# EAGLE design Grove - ADC for load cell (HX711) (EAGLE 9.2.2)
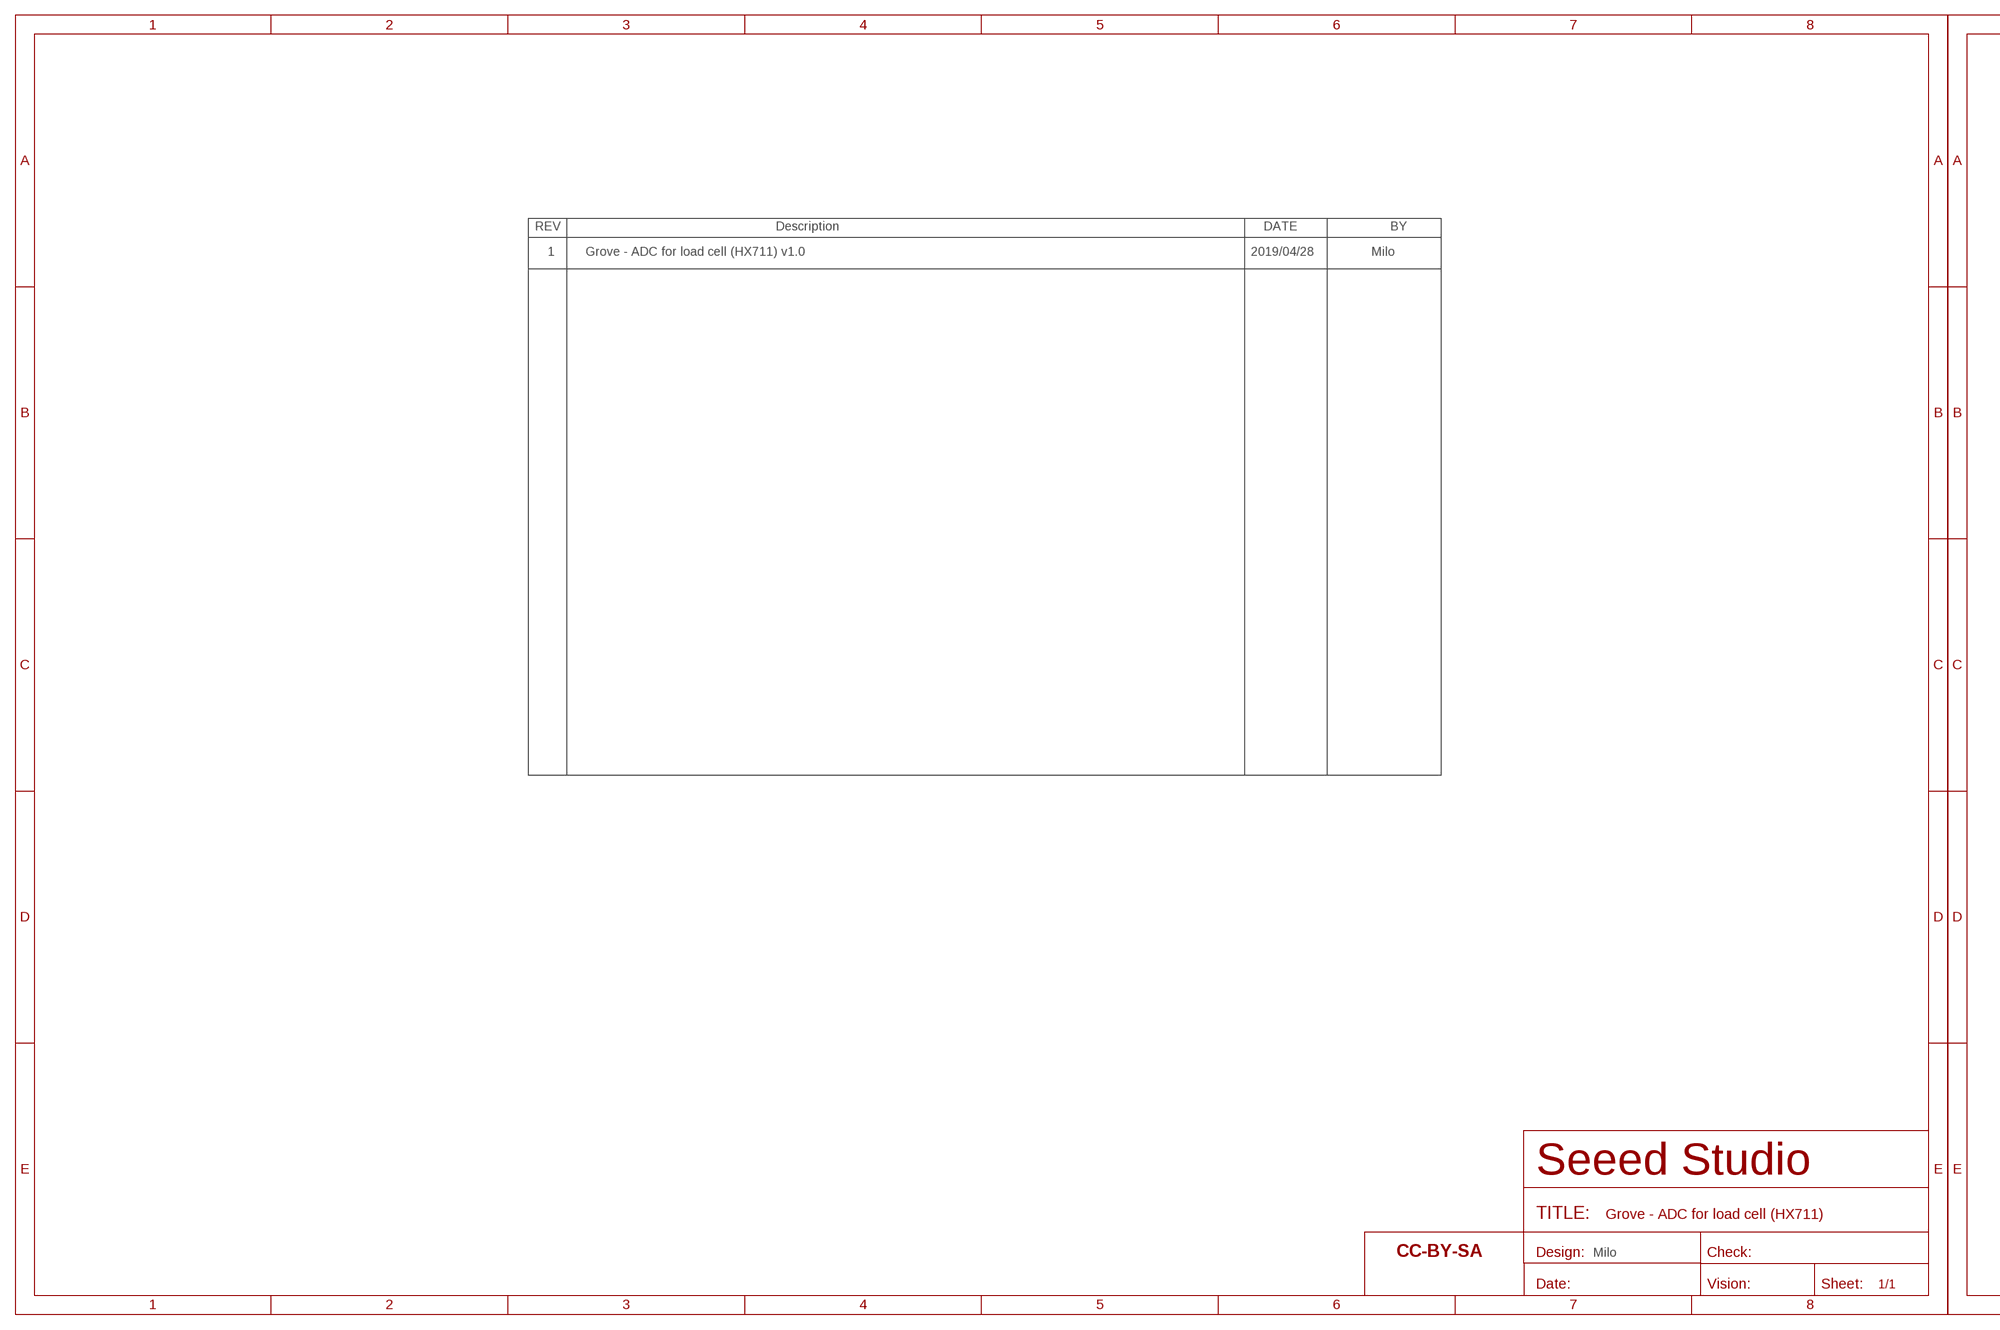
[diagram p0: schematic, sheet 1, part 1 of 2]
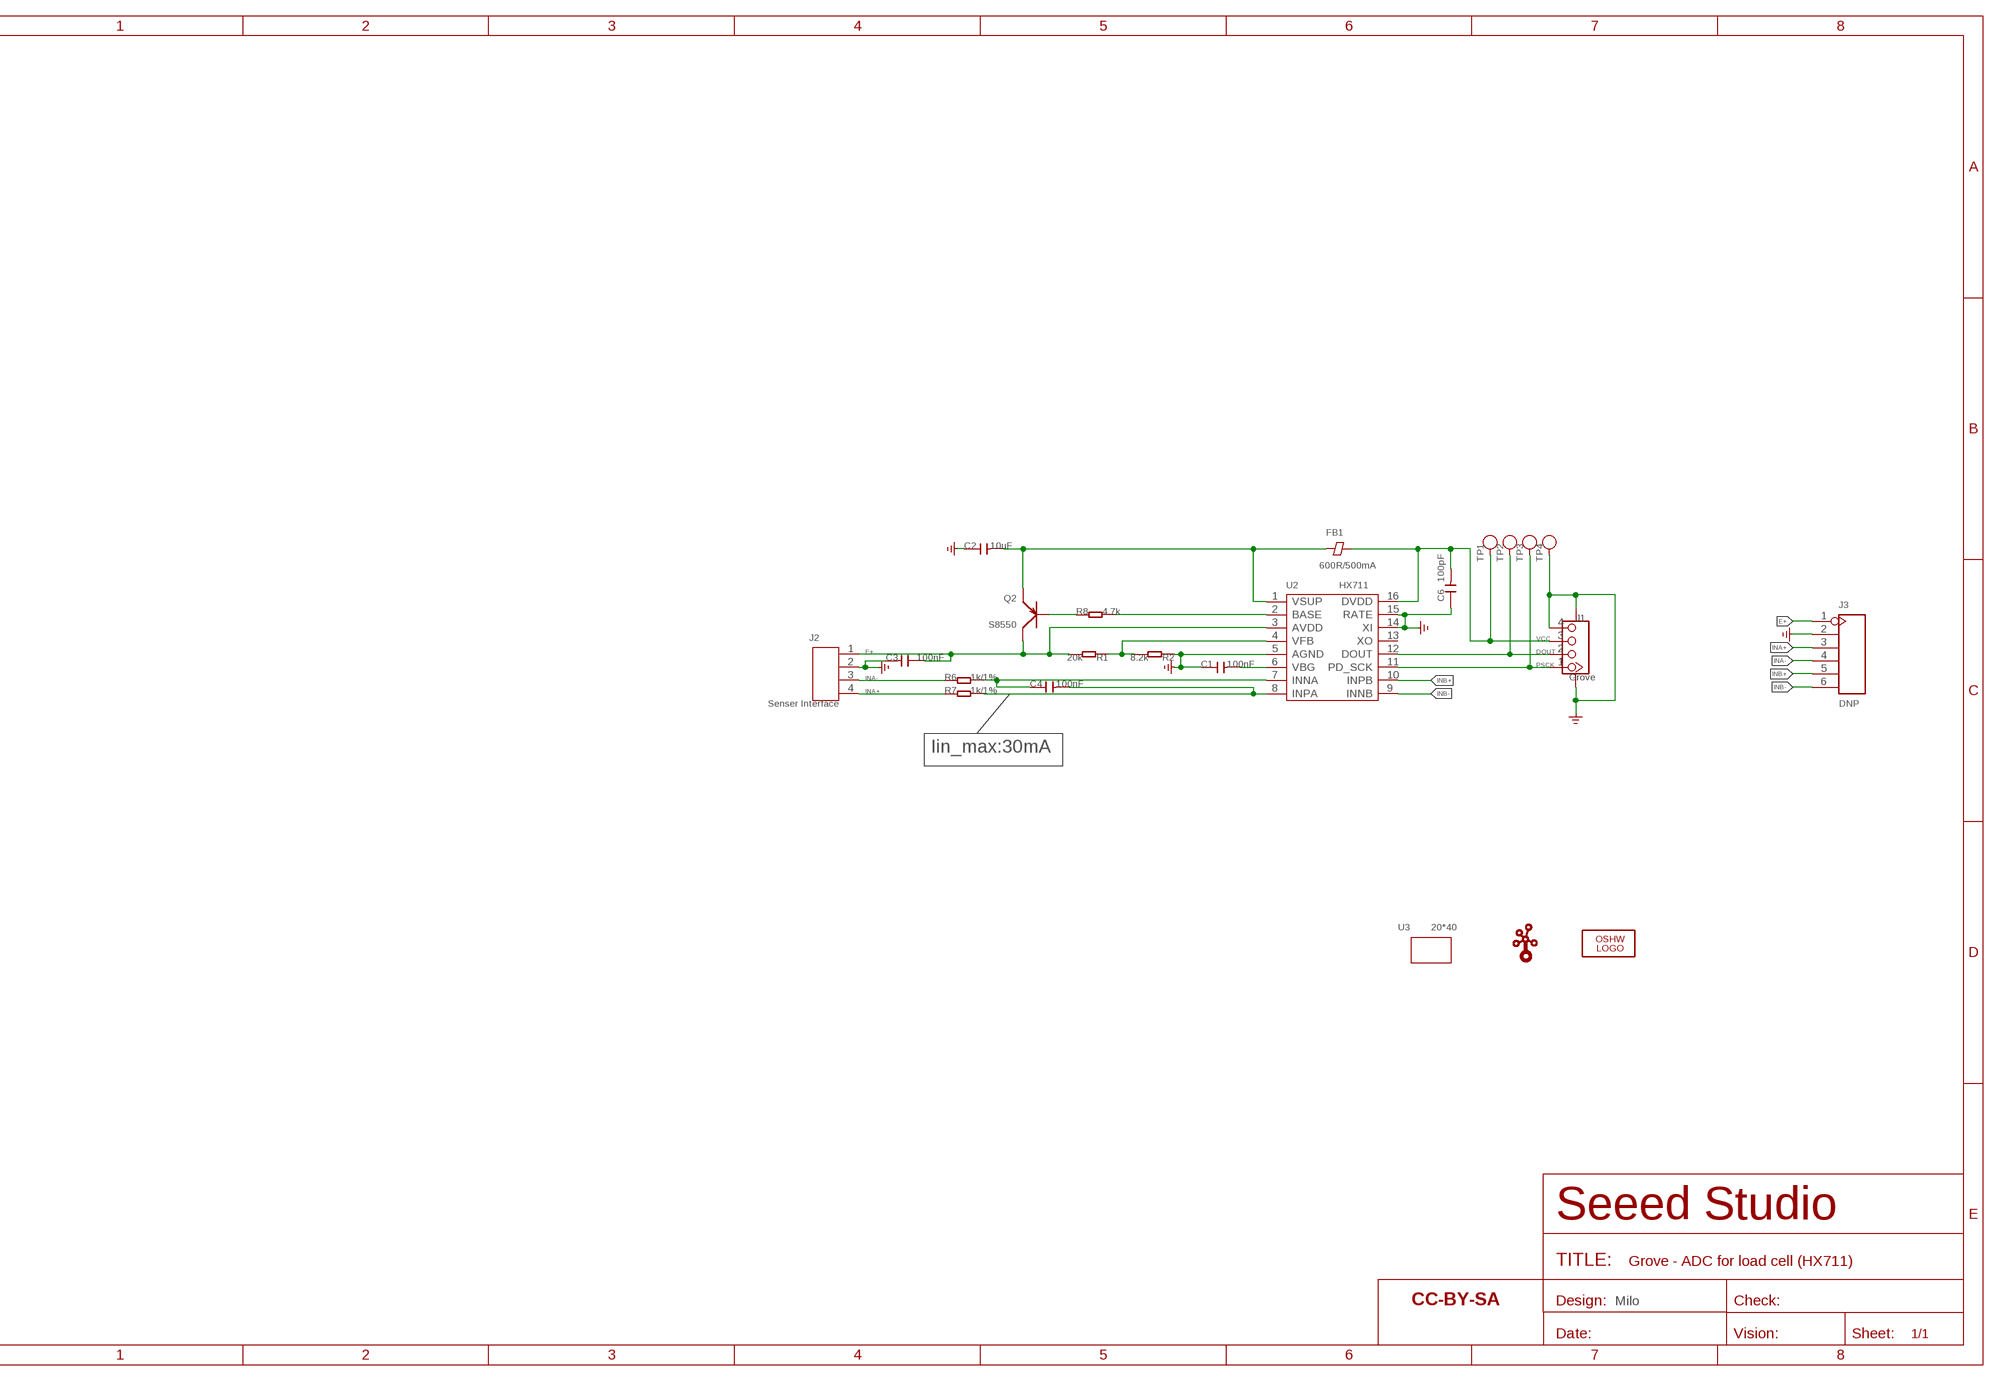
[diagram p1: schematic, sheet 1, part 2 of 2]

## Parts
C1  100nF  CAP-0603  [C0603]
C2  10uF  CAP-0603  [C0603]
C3  100nF  CAP-0603  [C0603]
C4  100nF  CAP-0603  [C0603]
C6  100pF  CAP-0603  [C0603]
FB1  600R/500mA  FERRITE-BEAD-0805  [F0805]
J1  Grove  GROVE-CONNECTOR-SMD-320110030  [HW4-SMD-2.0]
J2  Senser Interface  SCREW-TERMINAL-4P'3.5'  [H4-3.5-14.0X7.0MM]
J3  DNP  HEADER-6P-55/35MIL  [H6-2.54]
LOGO1  LOGO-OSHW-FILLX0150-NT  [OSHW_FILLX150_NOTEXT]
Q2  S8550  TRANSISTOR-PNP-SOT23  [SOT-23]
R1  20k  RES-0603  [R0603]
R2  8.2k  RES-0603  [R0603]
R6  1k/1%  RES-0603  [R0603]
R7  1k/1%  RES-0603  [R0603]
R8  4.7k  RES-0603  [R0603]
TP1  DNP  TEST-POINT'4545'  [TP-D45MIL]
TP2  DNP  TEST-POINT'4545'  [TP-D45MIL]
TP3  DNP  TEST-POINT'4545'  [TP-D45MIL]
TP4  DNP  TEST-POINT'4545'  [TP-D45MIL]
U2  HX711  CONVERTER-HX711  [SOIC16-1.27-10X3.9MM]
U3  20*40  GROVE-1X2-TOP  [GROVE-1*2-TEST-PLATFORM-TOP]
U$2  LOGO-GROVE  [GROVE-SILK-BIG]

## Nets
DOUT: J1.2 TP2.T U2.12(DOUT)
E+: C3.1 J2.1 J3.1 Q2.3(C) R1.2 U2.3(AVDD)
GND: C1.1 C2.1 C3.2 C6.1 J1.4 J1.SS1 J1.SS2 J2.2 J3.2 R2.1 TP4.T U2.5(AGND) U2.14(XI) U2.15(RATE) ; supply symbol labelled GND_POWER
INA+: J2.4 J3.3 R7.1
INA-: J2.3 J3.4 R6.1
INB+: J3.5 U2.10(INPB)
INB-: J3.6 U2.9(INNB)
N$2: R1.1 R2.2 U2.4(VFB)
N$4: Q2.1(B) R8.1
N$6: C2.2 FB1.1 Q2.2(E) U2.1(VSUP)
N$7: C1.2 U2.6(VBG)
N$10: R8.2 U2.2(BASE)
N$13: C4.2 R7.2 U2.8(INPA)
N$14: C4.1 R6.2 U2.7(INNA)
PSCK: J1.1 TP3.T U2.11(PD_SCK)
VCC: C6.2 FB1.2 J1.3 TP1.T U2.16(DVDD)
Unconnected: U2.13(XO)

## Notes on the sheet
- 1 | Grove - ADC for load cell (HX711) v1.0 | 2019/04/28 | Milo
- Iin_max:30mA
- Milo | Milo

## Library data of the parts
C1-C4 C6 = Discrete-new:CAP: Ceramic Capacitors
FB1 = Discrete-new:FERRITE-BEAD
J1 = Connector-new:GROVE-CONNECTOR-SMD
J2 = Connector-new:SCREW-TERMINAL-4P: 203000033
J3 = Connector-new:HEADER-6P
LOGO1 = logo:LOGO-OSHW-FILL; PARTNO: DNP
Q2 = Discrete-new:TRANSISTOR-PNP: PNP audion
R1 R2 R6-R8 = Discrete-new:RES
TP1-TP4 = Discrete-new:TEST-POINT; PARTNO: DNP
U2 = IC-new:CONVERTER-HX711: 电子秤专用模拟/数字（A/D）转换器芯片
U3 = moudle-new:GROVE
U$2 = logo:LOGO-GROVE; PARTNO: DNP

## Board
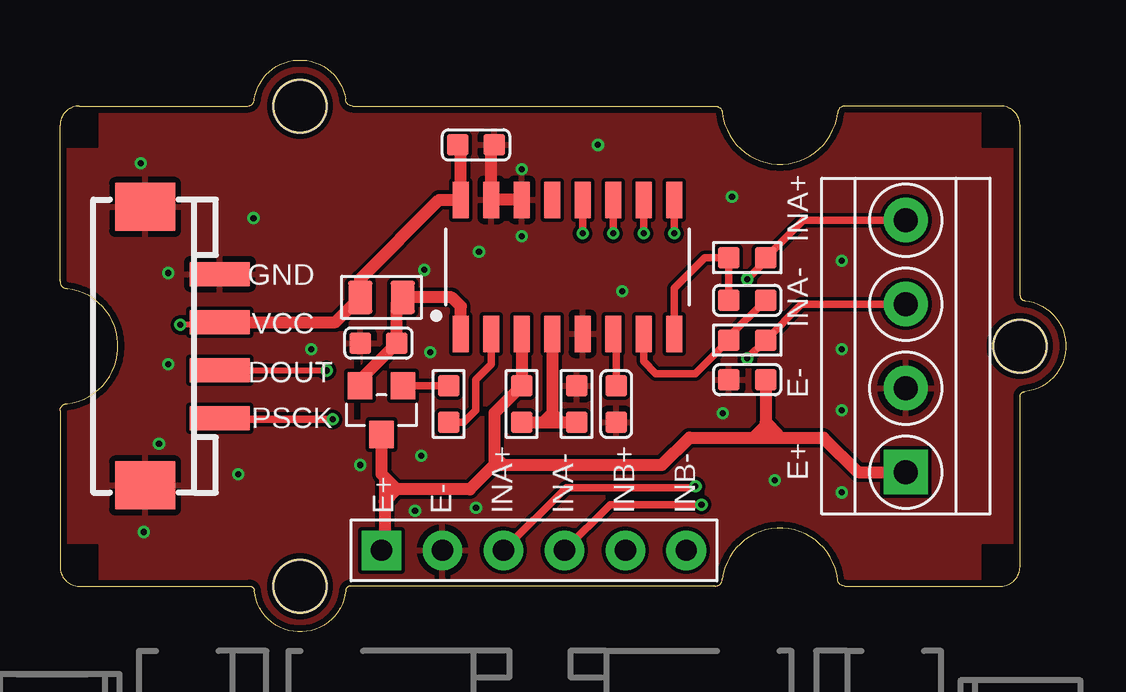
[diagram p2: board, top side]
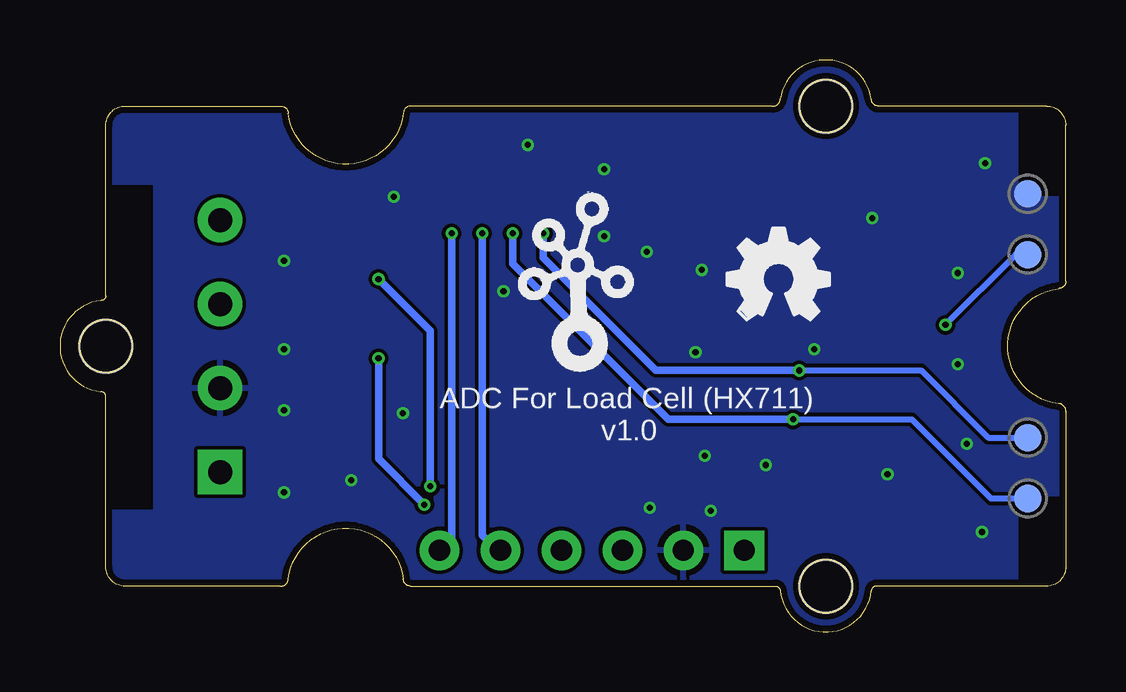
[diagram p3: board, bottom side, seen from below]

Size 41.91 x 23.83 mm. Coordinates in mm from the lower left corner, seen from the top.
Copper layers (1*16): Top 0.035mm / dielectric 1.5mm / Bottom 0.035mm
Design rules "SeeedStudio_2layer_DRU_no_angle_20140221 *": minimum track width 1mil, minimum drill 10mil, track to track 6mil, track to pad 6mil, pad to pad 6mil, via to via 6mil, smd to smd 0mil, copper to edge 10mil, drill to drill 10mil, minimum pad ring 4mil, minimum via ring 4mil, stop-mask expansion 2mil, vias tented up to drill 25mil, thermal gap 10mil
tRestrict: area 12.3,8.9 to 12.5,11.5

### Footprints (pad centres in the part's own frame; a part is rotated, then mirrored left to right if it is on the bottom)
C0603 = smd 0.889 x 0.889: 1 -0.762,0; 2 0.762,0
F0805 = smd 1.016 x 1.397: 1 -0.889,0; 2 0.889,0
HW4-SMD-2.0 = smd 1 x 2.5: 1 -3,0; 2 -1,0; 3 1,0; 4 3,0 | smd 2 x 2.5: SS1 -5.8,3.123; SS2 5.8,3.123
H4-3.5-14.0X7.0MM = drill 1 pad 1.85 square: 1 -5.25,0 | drill 1 pad 1.85: 2 -1.75,0; 3 1.75,0; 4 5.25,0
H6-2.54 = drill 0.889 pad 1.651 square: 1 0,6.35 | drill 0.889 pad 1.651: 2 0,3.81; 3 0,1.27; 4 0,-1.27; 5 0,-3.81; 6 0,-6.35
SOT-23 = smd 1.143 x 1.016: 1 1.016,-0.889; 2 1.016,0.889; 3 -1.016,0
R0603 = smd 0.889 x 0.889: 1 -0.762,0; 2 0.762,0
TP-D45MIL = smd 1.143 x 1.143: T 0,0
SOIC16-1.27-10X3.9MM = smd 0.66 x 1.524: 1 -4.445,-2.794; 2 -3.175,-2.794; 3 -1.905,-2.794; 4 -0.635,-2.794; 5 0.635,-2.794; 6 1.905,-2.794; 7 3.175,-2.794; 8 4.445,-2.794; 9 4.445,2.794; 10 3.175,2.794; 11 1.905,2.794; 12 0.635,2.794; 13 -0.635,2.794; 14 -1.905,2.794; 15 -3.175,2.794; 16 -4.445,2.794
GROVE-1*2-TEST-PLATFORM-TOP = hole 2.2: 10.635,10; 10.635,-10; -19.365,0

### Placement (x,y rotation side)
C1  23.18,9.5 90 top
C2  13.27,12.04 0 top
C3  28.64,10.51 180 top
C4  28.64,13.81 180 top
C6  17.33,20.29 180 top
FB1  13.4,13.94 180 top
J1  6.67,11.91 90 top
J2  35.24,11.91 90 top
J3  19.75,3.4 90 top
LOGO1  14.1,13.01 0 bottom
Q2  13.4,9.24 90 top
R1  19.24,9.5 90 top
R2  21.52,9.5 270 top
R6  28.64,12.16 180 top
R7  28.64,15.59 180 top
R8  16.19,9.5 270 top
TP1  1.59,15.72 0 bottom
TP2  1.59,8.1 0 bottom
TP3  1.59,5.56 0 bottom
TP4  1.59,18.26 0 bottom
U2  21.14,15.21 0 top
U3  20.64,11.91 180 top
U$2  20.31,11.82 0 bottom

### Tracks (layer width: path | path; a pad name or v marks a point on that pad's centre or on a via)
DOUT  (via drill 0.25 pad 0.51)
  Top 0.254: v11.11,10.89 6.68,10.89 J1.2
  Top 0.305: U2.12 v21.78,16.61
  Bottom 0.254: TP2.T 3.24,8.1 6.03,10.89 v11.11,10.89
  Bottom 0.305: v21.78,16.61 21.78,15.59 17.08,10.89 v11.11,10.89
E+
  Top 0.508: U2.3 R1.2 18.1,9.11 18.1,7.34 | J2.1 33.25,6.66 31.81,8.1 29.91,8.1 | 28.89,8.1 26.22,8.1 25.08,6.96 18.6,6.96 18.48,6.96 | 28.89,8.1 29.4,8.1 | 29.4,8.1 29.91,8.1 | C3.1 29.4,8.73 | 29.4,8.61 29.4,8.1 | 29.4,8.73 29.91,8.23 29.91,8.1 | 29.4,8.73 29.4,8.61 | 29.4,8.61 28.89,8.1 | Q2.3 13.4,6.57 13.52,6.45 | 14.03,5.94 13.52,6.45 | 13.52,6.45 13.52,5.43 | 13.52,5.43 13.52,3.53 J3.1 | 13.52,5.43 14.03,5.94 | 14.03,5.94 17.08,5.94 18.1,6.96 | 18.1,6.96 18.48,6.96 | 18.1,7.34 18.1,6.96 | 18.1,7.34 18.48,6.96
GND  (via drill 0.25 pad 0.51)
  Top 0.508: C6.1 17.97,20.16 U2.15 U2.14
  other vias: 14.79,5.05 17.33,5.18 29.78,6.32 12.51,6.96 15.05,7.34 15.43,11.65 10.48,11.78 15.17,15.08 17.46,15.85 23.43,14.19 22.41,20.29 28,18.13 32.57,15.46 32.57,11.78 32.57,9.24 32.57,5.81 27.62,9.11 19.24,19.27 19.24,16.48 8.06,17.24 3.36,19.53 4.51,14.96 4.51,11.15 4.12,7.84 3.49,4.16 7.43,6.57
  pour Top: -1.36,24.91 42.64,24.91 42.64,-0.09 -1.36,-0.09
  pour Bottom: -1.36,24.91 42.64,24.91 42.64,-0.09 -0.36,-0.09 -0.36,-1.09 -1.36,-1.09
INA+  (via drill 0.25 pad 0.51)
  Top 0.305: J2.4 30.97,17.16 R7.1 29.4,15.46 v28.64,14.7 | J3.3 21.09,6.02 26.43,6.02 v26.48,6.07
  Bottom 0.305: v28.64,14.7 26.48,12.54 v26.48,6.07
INA-  (via drill 0.25 pad 0.51)
  Top 0.305: J2.3 30.89,13.66 R6.1 v28.64,11.4 | J3.4 22.92,5.3 v26.73,5.3
  Bottom 0.305: v26.73,5.3 28.64,7.21 v28.64,11.4
INB+  (via drill 0.25 pad 0.51)
  Top 0.305: U2.10 v24.32,16.61
  Bottom 0.305: v24.32,16.61 24.32,4.03 23.68,3.4 J3.5
INB-  (via drill 0.25 pad 0.51)
  Top 0.305: U2.9 v25.59,16.61
  Bottom 0.305: v25.59,16.61 25.59,3.91 J3.6
N$2
  Top 0.508: R1.1 20.13,8.73 | 20.13,8.73 20.51,8.73 | U2.4 20.51,9.11 | 20.51,9.11 20.51,8.73 | 20.51,8.73 20.89,8.73 | 20.89,8.73 R2.2 | 20.89,8.73 20.51,9.11 | 20.13,8.73 20.51,9.11
N$4
  Top 0.305: R8.1 Q2.1
N$6
  Top 0.508: Q2.2 12.51,10.51 C2.2 14.03,13.69 FB1.1 16.32,13.94 16.7,13.56 U2.1
N$7
  Top 0.305: U2.6 23.18,12.29 C1.2
N$10
  Top 0.305: U2.2 17.97,11.15 17.33,10.51 17.33,9.24 16.83,8.73 R8.2
N$13
  Top 0.305: U2.8 25.59,14.32 26.86,15.59 R7.2 C4.2
N$14
  Top 0.305: C4.1 27.87,12.29 R6.2 26.48,10.77 24.83,10.77 24.32,11.27 U2.7
PSCK  (via drill 0.25 pad 0.51)
  Top 0.254: J1.1 6.71,8.86
  Top 0.305: U2.11 v23.05,16.61 | 6.71,8.86 v11.36,8.86
  Bottom 0.254: v11.36,8.86 6.41,8.86 3.11,5.56 TP3.T
  Bottom 0.305: v23.05,16.61 23.05,15.34 16.57,8.86 v11.36,8.86
VCC  (via drill 0.25 pad 0.51)
  Top 0.254: J1.3 6.55,12.8 v5.01,12.8
  Top 0.508: J1.3 11.48,12.91 FB1.2 12.51,14.7 15.81,18 U2.16 16.7,20.16 C6.2
  Bottom 0.254: v5.01,12.8 2.09,15.72 TP1.T

### Text on the board
tNames: INA+ | GND | VCC | INA- | DOUT | E- | PSCK | E+ | E+ | E- | INA+ | INA- | INB+ | INB-
bNames: ADC For Load Cell (HX711) / v1.0